# Altium project DIGITAL-CLOCK-WITH-7-SEGMENT-DISPLAY.PrjPcb
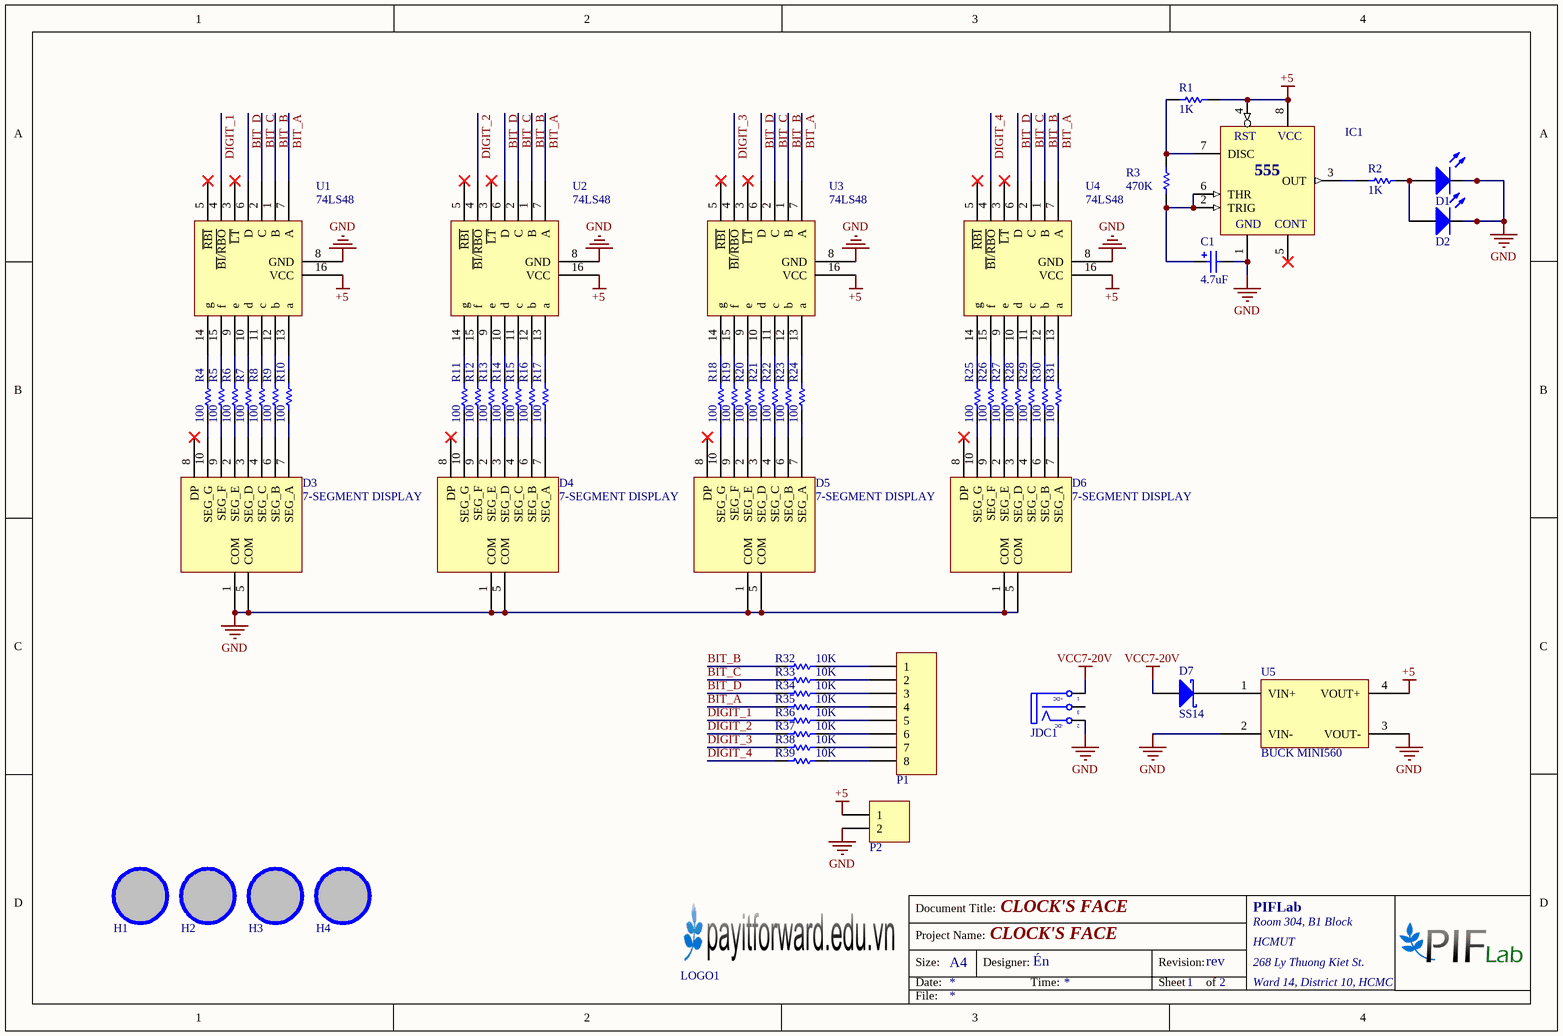
[diagram p0: 7-SEGMENT_DISPLAY_4_DIGITS.SchDoc]
2 sheets, 95 parts. Net scope: global (net labels, ports and power ports of the same name join across sheets).
Board files: 7-SEGMENT_DISPLAY_4_DIGITS.PcbDoc, BOARD-PANEL.PcbDoc, MCU_BOARD.PcbDoc, MCU_PANEL.PcbDoc
Sheets:
  7-SEGMENT_DISPLAY_4_DIGITS.SchDoc
  CONTROL-PANEL.SchDoc

## Sheet 7-SEGMENT_DISPLAY_4_DIGITS.SchDoc: CLOCK'S FACE
size A4; Author: Én; Organization: PIFLab; Address1: Room 304, B1 Block; Address2: HCMUT; Address3: 268 Ly Thuong Kiet St.; Address4: Ward 14, District 10, HCMC; Revision: rev; SheetNumber: 1; SheetTotal: 2; ProjectTitle: CLOCK'S FACE

### Parts
C1  value 4.7uF  [CP1/2]  (hidden comment: Cap Pol)
D1  LED  [LED-3mm]  (value not drawn)
D2  LED  [LED-3mm]  (value not drawn)
D3  7-SEGMENT DISPLAY  [7-SEGMENT]
D4  7-SEGMENT DISPLAY  [7-SEGMENT]
D5  7-SEGMENT DISPLAY  [7-SEGMENT]
D6  7-SEGMENT DISPLAY  [7-SEGMENT]
D7  Supplier Part Number 1: SS14  [SS34]  (hidden comment: D Schottky)
H1  Hole  [LO KHOAN 3MM]  (value not drawn)
H2  Hole  [LO KHOAN 3MM]  (value not drawn)
H3  Hole  [LO KHOAN 3MM]  (value not drawn)
H4  Hole  [LO KHOAN 3MM]  (value not drawn)
IC1  LM555  [DIP8/W0.3]  (value not drawn)
JDC1  Jack DC  [DC-IN]  (value not drawn)
LOGO1  LOGO PIF  [PIF LOGO BIG TOP]  (value not drawn)
P1  Header 8  [JP8]  (value not drawn)
P2  Header 2  [JP2]  (value not drawn)
R1  value 1K  [RES-SM-0805]  (hidden comment: RESISTOR SMD)
R2  value 1K  [RES-SM-0805]  (hidden comment: RESISTOR SMD)
R3  value 470K  [RES-SM-0805]  (hidden comment: RESISTOR SMD)
R4  value 100  [RES-SM-0805]  (hidden comment: RESISTOR SMD)
R5  value 100  [RES-SM-0805]  (hidden comment: RESISTOR SMD)
R6  value 100  [RES-SM-0805]  (hidden comment: RESISTOR SMD)
R7  value 100  [RES-SM-0805]  (hidden comment: RESISTOR SMD)
R8  value 100  [RES-SM-0805]  (hidden comment: RESISTOR SMD)
R9  value 100  [RES-SM-0805]  (hidden comment: RESISTOR SMD)
R10  value 100  [RES-SM-0805]  (hidden comment: RESISTOR SMD)
R11  value 100  [RES-SM-0805]  (hidden comment: RESISTOR SMD)
R12  value 100  [RES-SM-0805]  (hidden comment: RESISTOR SMD)
R13  value 100  [RES-SM-0805]  (hidden comment: RESISTOR SMD)
R14  value 100  [RES-SM-0805]  (hidden comment: RESISTOR SMD)
R15  value 100  [RES-SM-0805]  (hidden comment: RESISTOR SMD)
R16  value 100  [RES-SM-0805]  (hidden comment: RESISTOR SMD)
R17  value 100  [RES-SM-0805]  (hidden comment: RESISTOR SMD)
R18  value 100  [RES-SM-0805]  (hidden comment: RESISTOR SMD)
R19  value 100  [RES-SM-0805]  (hidden comment: RESISTOR SMD)
R20  value 100  [RES-SM-0805]  (hidden comment: RESISTOR SMD)
R21  value 100  [RES-SM-0805]  (hidden comment: RESISTOR SMD)
R22  value 100  [RES-SM-0805]  (hidden comment: RESISTOR SMD)
R23  value 100  [RES-SM-0805]  (hidden comment: RESISTOR SMD)
R24  value 100  [RES-SM-0805]  (hidden comment: RESISTOR SMD)
R25  value 100  [RES-SM-0805]  (hidden comment: RESISTOR SMD)
R26  value 100  [RES-SM-0805]  (hidden comment: RESISTOR SMD)
R27  value 100  [RES-SM-0805]  (hidden comment: RESISTOR SMD)
R28  value 100  [RES-SM-0805]  (hidden comment: RESISTOR SMD)
R29  value 100  [RES-SM-0805]  (hidden comment: RESISTOR SMD)
R30  value 100  [RES-SM-0805]  (hidden comment: RESISTOR SMD)
R31  value 100  [RES-SM-0805]  (hidden comment: RESISTOR SMD)
R32  value 10K  [RES-SM-0805]  (hidden comment: RESISTOR SMD)
R33  value 10K  [RES-SM-0805]  (hidden comment: RESISTOR SMD)
R34  value 10K  [RES-SM-0805]  (hidden comment: RESISTOR SMD)
R35  value 10K  [RES-SM-0805]  (hidden comment: RESISTOR SMD)
R36  value 10K  [RES-SM-0805]  (hidden comment: RESISTOR SMD)
R37  value 10K  [RES-SM-0805]  (hidden comment: RESISTOR SMD)
R38  value 10K  [RES-SM-0805]  (hidden comment: RESISTOR SMD)
R39  value 10K  [RES-SM-0805]  (hidden comment: RESISTOR SMD)
U1  74LS48  [74LS48]
U2  74LS48  [74LS48]
U3  74LS48  [74LS48]
U4  74LS48  [74LS48]
U5  BUCK MINI560  [BUCK MINI560]

### Nets
+5: IC1.4(RST) IC1.8(VCC) P2.1 R1.2 U1.16(VCC) U2.16(VCC) U3.16(VCC) U4.16(VCC) U5.4(VOUT+)
GND: C1.2 D1.2(K) D2.2(K) D3.1(COM) D3.5(COM) D4.1(COM) D4.5(COM) D5.1(COM) D5.5(COM) D6.1(COM) D6.5(COM) IC1.1(GND) JDC1.2(TN) P2.2 U1.8(GND) U2.8(GND) U3.8(GND) U4.8(GND) U5.2(VIN-) U5.3(VOUT-)
VCC7-20V: D7.A JDC1.1(T)
BIT_A: R35.1 U1.7(A) U2.7(A) U3.7(A) U4.7(A)
BIT_B: R32.1 U1.1(B) U2.1(B) U3.1(B) U4.1(B)
BIT_C: R33.1 U1.2(C) U2.2(C) U3.2(C) U4.2(C)
BIT_D: R34.1 U1.6(D) U2.6(D) U3.6(D) U4.6(D)
DIGIT_1: R36.1 U1.4(~{BI}/~{RBO})
DIGIT_2: R37.1 U2.4(~{BI}/~{RBO})
DIGIT_3: R38.1 U3.4(~{BI}/~{RBO})
DIGIT_4: R39.1 U4.4(~{BI}/~{RBO})
NetC1_1: C1.1 IC1.2(TRIG) IC1.6(THR) R3.1
NetD1_1: D1.1(A) D2.1(A) R2.2
NetD3_2: D3.2(SEG_E) R6.1
NetD3_3: D3.3(SEG_D) R7.1
NetD3_4: D3.4(SEG_C) R8.1
NetD3_6: D3.6(SEG_B) R9.1
NetD3_7: D3.7(SEG_A) R10.1
NetD3_9: D3.9(SEG_F) R5.1
NetD3_10: D3.10(SEG_G) R4.1
NetD4_2: D4.2(SEG_E) R13.1
NetD4_3: D4.3(SEG_D) R14.1
NetD4_4: D4.4(SEG_C) R15.1
NetD4_6: D4.6(SEG_B) R16.1
NetD4_7: D4.7(SEG_A) R17.1
NetD4_9: D4.9(SEG_F) R12.1
NetD4_10: D4.10(SEG_G) R11.1
NetD5_2: D5.2(SEG_E) R20.1
NetD5_3: D5.3(SEG_D) R21.1
NetD5_4: D5.4(SEG_C) R22.1
NetD5_6: D5.6(SEG_B) R23.1
NetD5_7: D5.7(SEG_A) R24.1
NetD5_9: D5.9(SEG_F) R19.1
NetD5_10: D5.10(SEG_G) R18.1
NetD6_2: D6.2(SEG_E) R27.1
NetD6_3: D6.3(SEG_D) R28.1
NetD6_4: D6.4(SEG_C) R29.1
NetD6_6: D6.6(SEG_B) R30.1
NetD6_7: D6.7(SEG_A) R31.1
NetD6_9: D6.9(SEG_F) R26.1
NetD6_10: D6.10(SEG_G) R25.1
NetD7_K: D7.K U5.1(VIN+)
NetIC1_3: IC1.3(OUT) R2.1
NetIC1_7: IC1.7(DISC) R1.1 R3.2
NetP1_1: P1.1 R32.2
NetP1_2: P1.2 R33.2
NetP1_3: P1.3 R34.2
NetP1_4: P1.4 R35.2
NetP1_5: P1.5 R36.2
NetP1_6: P1.6 R37.2
NetP1_7: P1.7 R38.2
NetP1_8: P1.8 R39.2
NetR4_2: R4.2 U1.14(g)
NetR5_2: R5.2 U1.15(f)
NetR6_2: R6.2 U1.9(e)
NetR7_2: R7.2 U1.10(d)
NetR8_2: R8.2 U1.11(c)
NetR9_2: R9.2 U1.12(b)
NetR10_2: R10.2 U1.13(a)
NetR11_2: R11.2 U2.14(g)
NetR12_2: R12.2 U2.15(f)
NetR13_2: R13.2 U2.9(e)
NetR14_2: R14.2 U2.10(d)
NetR15_2: R15.2 U2.11(c)
NetR16_2: R16.2 U2.12(b)
NetR17_2: R17.2 U2.13(a)
NetR18_2: R18.2 U3.14(g)
NetR19_2: R19.2 U3.15(f)
NetR20_2: R20.2 U3.9(e)
NetR21_2: R21.2 U3.10(d)
NetR22_2: R22.2 U3.11(c)
NetR23_2: R23.2 U3.12(b)
NetR24_2: R24.2 U3.13(a)
NetR25_2: R25.2 U4.14(g)
NetR26_2: R26.2 U4.15(f)
NetR27_2: R27.2 U4.9(e)
NetR28_2: R28.2 U4.10(d)
NetR29_2: R29.2 U4.11(c)
NetR30_2: R30.2 U4.12(b)
NetR31_2: R31.2 U4.13(a)

Not connected (* = marked no-connect by the designer): D3 8(DP)*; D4 8(DP)*; D5 8(DP)*; D6 8(DP)*; H1 1; H2 1; H3 1; H4 1; IC1 5(CONT)*; JDC1 3(S); U1 3(~{LT})* 5(~{RBI})*; U2 3(~{LT})* 5(~{RBI})*; U3 3(~{LT})* 5(~{RBI})*; U4 3(~{LT})* 5(~{RBI})*

### Notes on the sheet
- Document Title:
- Size:
- Date:
- Project Name:
- A4
- Designer:
- Time:
- Revision:
- Sheet
- of
- File:
- (in symbol Jack DC) +DC; -DC
- (in symbol LM555) 555

### Library data of the parts
C1 = Cap Pol: Polarized Capacitor (Radial)
D3-D6 = 7-SEGMENT
D7 = D Schottky: Schottky Diode; Published: 8-Jun-2000; LatestRevisionDate: 17-Jul-2002; LatestRevisionNote: Re-released for DXP Platform.; PackageReference: SMB; Publisher: Altium Limited; PackageDescription: DO-214-AA/SMB; 2 C-Bend Leads; Body 5.3 x 3.6 mm, inc. leads (LxW); Code_JEDEC: DO-214-AA; Supplier 1: Arrow Electronics; Supplier 2: RSComponents; Supplier Part Number 2: 8080433
H1-H4 = Hole: Hole 3mm
IC1 = LM555: Timer; Value: LM555
JDC1 = Jack DC: Jack DC input; Value: Jac DC
P1 = Header 8: Header, 8-Pin; LatestRevisionDate: 17-Jul-2002; LatestRevisionNote: Re-released for DXP Platform.; Publisher: Altium Limited
P2 = Header 2: Header, 2-Pin; LatestRevisionDate: 17-Jul-2002; LatestRevisionNote: Re-released for DXP Platform.; Publisher: Altium Limited
R1-R39 = RESISTOR SMD: Resistor
U1-U4 = 74LS48: 74LS48 - ACTIVE HIGH
U5 = BUCK MINI560: MODULE BUCK MINI560

## Sheet CONTROL-PANEL.SchDoc: DIGITAL CLOCK MCU
size A4; Author: Én; Organization: PIF Club; Address1: Room 304, B1 Block; Address2: HCMUT; Address3: 268 Ly Thuong Kiet St.; Address4: Ward 14, District 10, HCMC; Revision: v1.0; SheetNumber: 2; SheetTotal: 2; ProjectTitle: DIGITAL CLOCK MCU
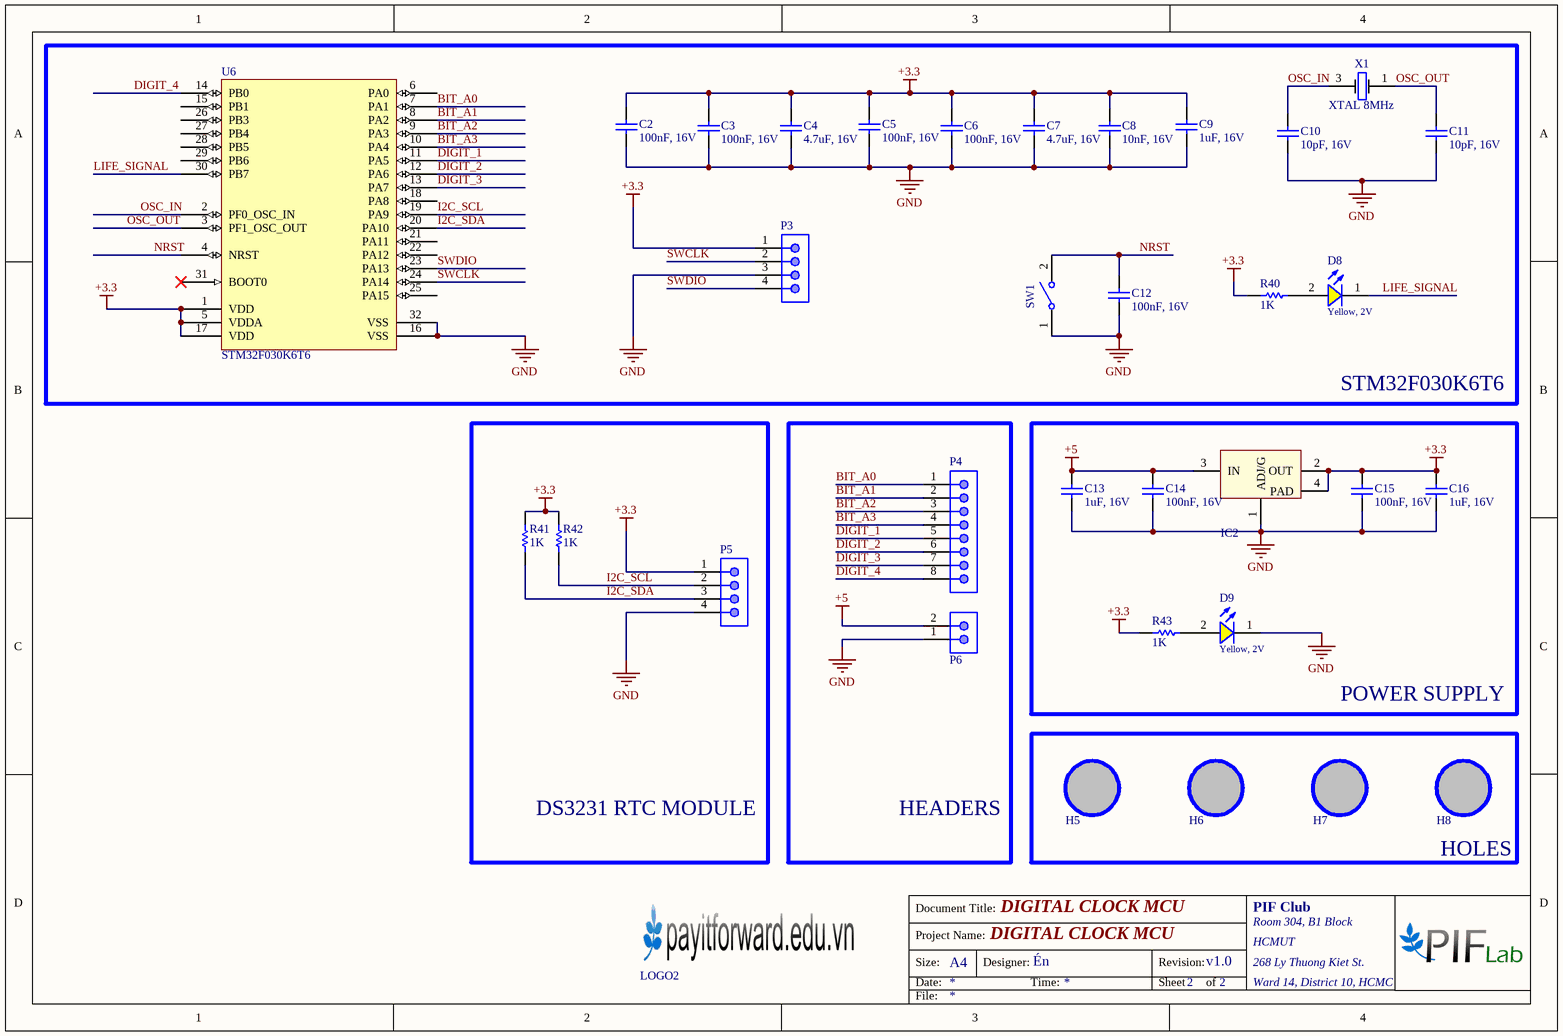
[diagram p1: CONTROL-PANEL.SchDoc]

### Parts
C2  value 100nF, 16V  [CAP-SM-0603]  (hidden comment: Cap Non-Pol SMD)
C3  value 100nF, 16V  [CAP-SM-0603]  (hidden comment: Cap Non-Pol SMD)
C4  value 4.7uF, 16V  [CAP-SM-0603]  (hidden comment: Cap Non-Pol SMD)
C5  value 100nF, 16V  [CAP-SM-0603]  (hidden comment: Cap Non-Pol SMD)
C6  value 100nF, 16V  [CAP-SM-0603]  (hidden comment: Cap Non-Pol SMD)
C7  value 4.7uF, 16V  [CAP-SM-0603]  (hidden comment: Cap Non-Pol SMD)
C8  value 10nF, 16V  [CAP-SM-0603]  (hidden comment: Cap Non-Pol SMD)
C9  value 1uF, 16V  [CAP-SM-0603]  (hidden comment: Cap Non-Pol SMD)
C10  value 10pF, 16V  [CAP-SM-0603]  (hidden comment: Cap Non-Pol SMD)
C11  value 10pF, 16V  [CAP-SM-0603]  (hidden comment: Cap Non-Pol SMD)
C12  value 100nF, 16V  [CAP-SM-0603]  (hidden comment: Cap Non-Pol SMD)
C13  value 1uF, 16V  [CAP-SM-0603]  (hidden comment: Cap Non-Pol SMD)
C14  value 100nF, 16V  [CAP-SM-0603]  (hidden comment: Cap Non-Pol SMD)
C15  value 100nF, 16V  [CAP-SM-0603]  (hidden comment: Cap Non-Pol SMD)
C16  value 1uF, 16V  [CAP-SM-0603]  (hidden comment: Cap Non-Pol SMD)
D8  Yellow, 2V  [WL-SMCW_0603_H=0.7mm]
D9  Yellow, 2V  [WL-SMCW_0603_H=0.7mm]
H5  Hole  [LO KHOAN 3MM]  (value not drawn)
H6  Hole  [LO KHOAN 3MM]  (value not drawn)
H7  Hole  [LO KHOAN 3MM]  (value not drawn)
H8  Hole  [LO KHOAN 3MM]  (value not drawn)
IC2  LM1117  [SOT223-4N]  (value not drawn)
LOGO2  LOGO PIF  [PIF LOGO SMALL SSTOP]  (value not drawn)
P3  61900411121  [61900411121]  (value not drawn)
P4  62000811622  [62000811622]  (value not drawn)
P5  62000411622  [62000411622]  (value not drawn)
P6  62000211622  [62000211622]  (value not drawn)
R40  value 1K  [RES-SM-0603]  (hidden comment: RESISTOR SMD)
R41  value 1K  [RES-SM-0603]  (hidden comment: RESISTOR SMD)
R42  value 1K  [RES-SM-0603]  (hidden comment: RESISTOR SMD)
R43  value 1K  [RES-SM-0603]  (hidden comment: RESISTOR SMD)
SW1  434111025826  [WS-TASV_L6W3.8H2.5_4341x10258x6]  (value not drawn)
U6  STM32F030K6T6  [STM32F030K6T6]
X1  XTAL 8MHz  [XTAL 3225]

### Blocks framed on the sheet
STM32F030K6T6: C2-C12 D8 P3 R40 SW1 U6 X1
DS3231 RTC MODULE: P5 R41 R42
HEADERS: P4 P6
POWER SUPPLY: C13-C16 D9 IC2 R43
HOLES: H5-H8

### Nets
+3.3: C2.2 C3.2 C4.2 C5.2 C6.2 C7.2 C8.2 C9.2 C15.2 C16.2 IC2.2(OUT) IC2.4(PAD) P3.1 P5.1 R40.2 R41.1 R42.1 R43.2 U6.1(VDD) U6.5(VDDA) U6.17(VDD)
+5: C13.2 C14.2 IC2.3(IN) P6.2
GND: C2.1 C3.1 C4.1 C5.1 C6.1 C7.1 C8.1 C9.1 C10.1 C11.1 C12.1 C13.1 C14.1 C15.1 C16.1 D9.1(K) IC2.1(ADJ/G) P3.3 P5.4 P6.1 SW1.1 U6.16(VSS) U6.32(VSS)
BIT_A0: P4.1 U6.7(PA1)
BIT_A1: P4.2 U6.8(PA2)
BIT_A2: P4.3 U6.9(PA3)
BIT_A3: P4.4 U6.10(PA4)
DIGIT_1: P4.5 U6.11(PA5)
DIGIT_2: P4.6 U6.12(PA6)
DIGIT_3: P4.7 U6.13(PA7)
DIGIT_4: P4.8 U6.14(PB0)
I2C_SCL: P5.2 R42.2 U6.19(PA9)
I2C_SDA: P5.3 R41.2 U6.20(PA10)
LIFE_SIGNAL: D8.1(K) U6.30(PB7)
NRST: C12.2 SW1.2 U6.4(NRST)
OSC_IN: C10.2 U6.2(PF0_OSC_IN) X1.3
OSC_OUT: C11.2 U6.3(PF1_OSC_OUT) X1.1
SWCLK: P3.2 U6.24(PA14)
SWDIO: P3.4 U6.23(PA13)
NetD8_2: D8.2(A) R40.1
NetD9_2: D9.2(A) R43.1

Not connected (* = marked no-connect by the designer): H5 1; H6 1; H7 1; H8 1; U6 6(PA0) 15(PB1) 18(PA8) 21(PA11) 22(PA12) 25(PA15) 26(PB3) 27(PB4) 28(PB5) 29(PB6) 31(BOOT0)*

### Notes on the sheet
- Document Title:
- Size:
- Date:
- Project Name:
- A4
- Designer:
- Time:
- Revision:
- Sheet
- of
- File:

### Library data of the parts
C2-C16 = Cap Non-Pol SMD: Capacitor
D8 D9 = 150060YS75000: WL-SMCW SMT Mono-color Chip LED Waterclear, size 0603, Yellow, 2V, 140deg; Chip Technology: AlInGaP; Dominant Wavelength typ.: 590nm; Luminous Intensity typ.: 120mcd; Peak Wavelength typ.: 595nm; Viewing Angle: 140deg; ComponentLink1Description: Manufacturer; ComponentLink1URL: http://www.we-online.de; ComponentLink2URL: https://www.we-online.com/catalog/datasheet/150060YS75000.pdf; ComponentLink2Description: Datasheet; Forward Voltage typ.: 2V; Emitting Color: Yellow; Mounting Technology: SMT; Operating Temperature: -40 to +85degC; Published Date: December 2019; Part Number: 150060YS75000; Packaging: Tape and Reel; Size: 0603; Publisher: Wurth Elektronik
H5-H8 = Hole: Hole 3mm
IC2 = LM1117: Available in 1.8V, 2.5V, 2.85V, 3.3V, 5V, and  Adjustable Versions; Value: LM1117
P3 = 61900411121: WR-WTB THT Male Vertical Locking Header, pitch 2.54mm, 4p; Pin Number: 4; Contact Resistance: 20mOhm; Rated Current: 3A; Withstanding Voltage: 1000VAC; Working Voltage: 250VAC; ComponentLink1Description: Manufacturer; ComponentLink1URL: http://www.we-online.de; ComponentLink2Description: Datasheet; ComponentLink2URL: https://www.we-online.com/catalog/datasheet/61900411121.pdf; Pitch: 2.54mm; Published Date: January 2020; Publisher: Wurth Elektronik; Mounting Technology: THT; Packaging: Bag; Operating Temperature: -40 to +105degC; Part Number: 61900411121; Gender: Male; Type: Vertical
P4 = 62000811622: WR-WTB Male Vertical Shrouded Header, pitch 2mm, 8p; Pin Number: 8; Contact Resistance: 20mOhm; Rated Current: 2A; Withstanding Voltage: 800VAC; Working Voltage: 125VAC; ComponentLink1Description: Manufacturer; ComponentLink1URL: http://www.we-online.de; ComponentLink2Description: Datasheet; ComponentLink2URL: https://www.we-online.com/catalog/datasheet/62000811622.pdf; Pitch: 2mm; Published Date: January 2020; Publisher: Wurth Elektronik; Mounting Technology: THT; Packaging: Bag; Operating Temperature: -25 to +85degC; Part Number: 62000811622; Gender: Male; Type: Vertical
P5 = 62000411622: WR-WTB Male Vertical Shrouded Header, pitch 2mm, 4p; Pin Number: 4; Contact Resistance: 20mOhm; Rated Current: 2A; Withstanding Voltage: 800VAC; Working Voltage: 125VAC; ComponentLink1Description: Manufacturer; ComponentLink1URL: http://www.we-online.de; ComponentLink2Description: Datasheet; ComponentLink2URL: https://www.we-online.com/catalog/datasheet/62000411622.pdf; Pitch: 2mm; Published Date: January 2020; Publisher: Wurth Elektronik; Mounting Technology: THT; Packaging: Bag; Operating Temperature: -25 to +85degC; Part Number: 62000411622; Gender: Male; Type: Vertical
P6 = 62000211622: WR-WTB Male Vertical Shrouded Header, pitch 2mm, 2p; Pin Number: 2; Contact Resistance: 20mOhm; Rated Current: 2A; Withstanding Voltage: 800VAC; Working Voltage: 125VAC; ComponentLink1Description: Manufacturer; ComponentLink1URL: http://www.we-online.de; ComponentLink2Description: Datasheet; ComponentLink2URL: https://www.we-online.com/catalog/datasheet/62000211622.pdf; Pitch: 2mm; Published Date: January 2020; Publisher: Wurth Elektronik; Mounting Technology: THT; Packaging: Bag; Operating Temperature: -25 to +85degC; Part Number: 62000211622; Gender: Male; Type: Vertical
R40-R43 = RESISTOR SMD: Resistor
SW1 = 434111025826: WS-TASV SMT Tact Switch, 12VDC, 50mA, 260g, height 2.5mm; Manufacturer: Wurth Elektronik; Rated Voltage: 12V; Washable: No; Actuator Color: White; Electrical Life: 30000Cycles; ComponentLink1Description: Manufacturer Link; ComponentLink1URL: http://www.we-online.de; ComponentLink2Description: Datasheet; ComponentLink2URL: https://www.we-online.com/catalog/datasheet/434111025826.pdf; Manufacturer Part Number: 434111025826; Contact Material: Stainless Steel; Mounting Technology: SMT; Contact Plating: Silver; Operation Force: 260g; Packaging: Tape and Reel; Terminal Material: Copper Alloy; Rated Current: 50mA; Terminal Plating: Silver; Height: 2.5mm; Length: 6mm; Operating Temperature max.: 85C; Operating Temperature min.: -40C; Width: 3.8mm
U6 = STM32F030K6T6: ARM Cortex M0 Microcontroller IC 32-Bit 48MHz 32KB FLASH, 32-LQFP; Mfr: STMicroelectronics; Number of I/O: 26; Program Memory Size: 32KB (32K x 8); Connectivity: I²C, SPI, UART/USART; Peripherals: DMA, POR, PWM, WDT; Speed: 48MHz; Package / Case: 32-LQFP; Program Memory Type1: FLASH
X1 = XTAL: Value: 8MHz

## Nets that join several sheets
+5: 7-SEGMENT_DISPLAY_4_DIGITS (9 pins), CONTROL-PANEL (C13.2 C14.2 IC2.3 P6.2)
GND: 7-SEGMENT_DISPLAY_4_DIGITS (20 pins), CONTROL-PANEL (23 pins)
DIGIT_1: 7-SEGMENT_DISPLAY_4_DIGITS (R36.1 U1.4), CONTROL-PANEL (P4.5 U6.11)
DIGIT_2: 7-SEGMENT_DISPLAY_4_DIGITS (R37.1 U2.4), CONTROL-PANEL (P4.6 U6.12)
DIGIT_3: 7-SEGMENT_DISPLAY_4_DIGITS (R38.1 U3.4), CONTROL-PANEL (P4.7 U6.13)
DIGIT_4: 7-SEGMENT_DISPLAY_4_DIGITS (R39.1 U4.4), CONTROL-PANEL (P4.8 U6.14)